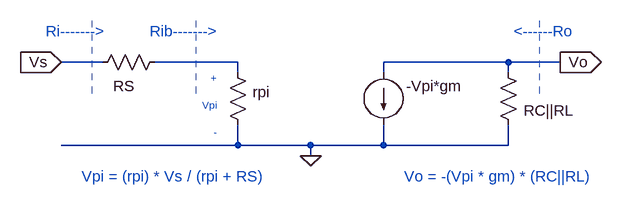
[diagram p0: schematic small_signal_AC_equivalent.asc]
small_signal_AC_equivalent.asc, the LTspice schematic file:
Version 4
SHEET 1 880 680
WIRE -160 32 -224 32
WIRE 48 32 -80 32
WIRE 464 32 272 32
WIRE 544 32 464 32
WIRE 48 48 48 32
WIRE 272 48 272 32
WIRE 464 48 464 32
WIRE 48 160 48 128
WIRE 48 160 -224 160
WIRE 160 160 48 160
WIRE 272 160 272 128
WIRE 272 160 160 160
WIRE 464 160 464 128
WIRE 464 160 272 160
WIRE 160 176 160 160
FLAG 544 32 Vo
IOPIN 544 32 Out
FLAG -224 32 Vs
IOPIN -224 32 In
FLAG 160 176 0
SYMBOL res 32 32 R0
WINDOW 0 39 46 Left 2
SYMATTR InstName rpi
SYMATTR Value ""
SYMBOL res 448 32 R0
WINDOW 0 40 74 Left 2
SYMATTR InstName RC||RL
SYMATTR Value ""
SYMBOL res -64 16 R90
WINDOW 0 68 63 VBottom 2
WINDOW 3 32 56 VTop 2
SYMATTR InstName RS
SYMATTR Value ""
SYMBOL current 272 48 R0
WINDOW 0 35 21 Left 2
SYMATTR InstName -Vpi*gm
SYMATTR Value ""
TEXT 16 56 Right 1 ;+\n \nVpi\n \n-
TEXT -248 -16 Left 2 ;Ri------->
TEXT -88 -16 Left 2 ;Rib------->
TEXT 472 -16 Left 2 ;<------Ro
TEXT -192 208 Left 2 ;Vpi = (rpi) * Vs / (rpi + RS)
TEXT 304 208 Left 2 ;Vo = -(Vpi * gm) * (RC||RL)
LINE Normal -176 80 -176 -32 2
LINE Normal -16 80 -16 -32 2
LINE Normal 512 80 512 -32 2

The netlist it stands for:
* small_signal_AC_equivalent.asc
rpi N001 0
RC||RL Vo 0
RS N001 Vs
I§-Vpi*gm Vo 0
* +
* Vpi
* -
* Ri------->
* Rib------->
* <------Ro
* Vpi = (rpi) * Vs / (rpi + RS)
* Vo = -(Vpi * gm) * (RC||RL)
.backanno
.end